# Altium project ATMEGA328P.PrjPcb
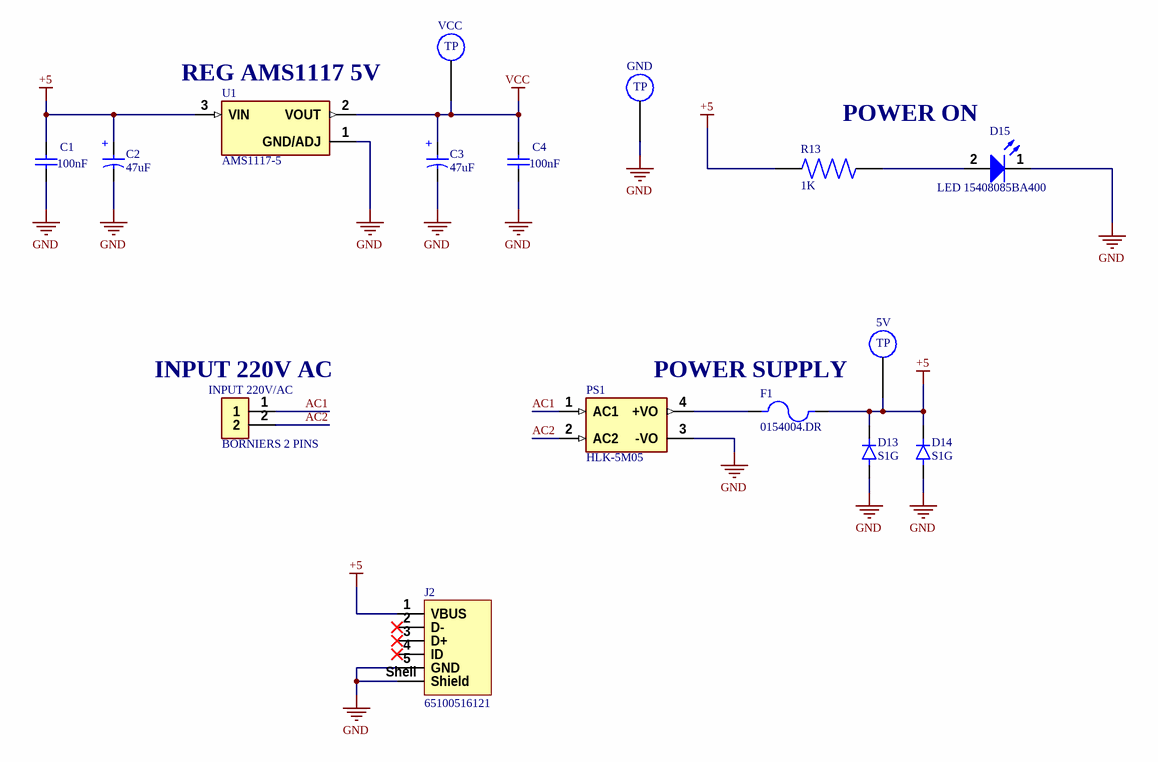
[diagram p0: Power.SchDoc]
3 sheets, 75 parts. Net scope: global (net labels, ports and power ports of the same name join across sheets).
Board file: ATMEGA328P.PcbDoc
Sheets:
  Power.SchDoc
  Controller.SchDoc
  Relay.SchDoc

## Sheet Power.SchDoc
size A4; SheetNumber: 1; SheetTotal: 3

### Parts
5V  TEST POINT  [TEST POINT]  (value not drawn)  (no BOM)
C1  100nF  [WCAP-CSGP_0603_L1.6W0.8H0.8_Reflow]
C2  Capacitance: 47uF  [Cap 865080443007]  (hidden comment: Cap 865080443007)
C3  Capacitance: 47uF  [Cap 865080443007]  (hidden comment: Cap 865080443007)
C4  100nF  [WCAP-CSGP_0603_L1.6W0.8H0.8_Reflow]
D13  S1G  [S1G]
D14  S1G  [S1G]
D15  LED 15408085BA400  [LED 15408085BA400]
F1  0154004.DR  [0154004.DR]
GND  TEST POINT  [TEST POINT]  (value not drawn)  (no BOM)
INPUT_220V/AC  BORNIERS 2 PINS  [BORNIERS 2 PINS]
J2  65100516121  [WR-USB-65100516121]
PS1  HLK-5M05  [HLK-5M05]
R13  1K  [RES FCR1206J10R]
U1  AMS1117-5  [AMS1117-5]
VCC  TEST POINT  [TEST POINT]  (value not drawn)  (no BOM)

### Nets
+5: 5V.1 C1.2 C2.1(P) D13.1(K) D14.1(K) F1.2 J2.1(VBUS) R13.1 U1.3(VIN)
GND: C1.1 C2.2(N) C3.2(N) C4.1 D13.2(A) D14.2(A) D15.1(K) GND.1 J2.5(GND) J2.Shell(Shield) PS1.3(-VO) U1.1(GND/ADJ)
VCC: C3.1(P) C4.2 U1.2(VOUT) VCC.1
AC1: INPUT_220V/AC.1 PS1.1(AC1)
AC2: INPUT_220V/AC.2 PS1.2(AC2)
NetD15_2: D15.2(A) R13.2
NetF1_1: F1.1 PS1.4(+VO)

Not connected (* = marked no-connect by the designer): J2 2(D-)* 3(D+)* 4(ID)*

### Notes on the sheet
- (near VCC) VCC
- (near U1) REG AMS1117 5V
- (near GND) GND
- (near R13) POWER ON
- (near 5V) 5V
- (near INPUT_220V/AC) INPUT 220V AC
- POWER SUPPLY
- (in symbol Cap 865080443007) +
- (in symbol TEST POINT) TP

### Library data of the parts
C1 C4 = 885012206071: WCAP-CSGP Multilayer Ceramic Chip Capacitor, General Purpose, size 0603, 100nF, 25V; Manufacturer: Wurth Elektronik; Case/Size Code: 0603; Capacitance Tolerance: +/-10%; Ceramic Type: X7R; Dissipation Factor: 3.5%; Insulation Resistance: 5GΩ; Technical Reference: X7R0603104K025DFCT10000; Manufacturer Part Number: 885012206071; Category: Multilayer Ceramic Chip Capacitors; Match Code: WCAP-CSGP; ComponentLink1Description: Website Link; ComponentLink1URL: https://www.we-online.com/redexpert/article/885012206071?ad; ComponentLink2Description: Datasheet Link; ComponentLink2URL: https://www.we-online.com/redexpert/spec/885012206071?ad; Mount: Surface Mount; Min Operating Temperature: -55°C; Max Operating Temperature: 125°C; Packaging: Tape and Reel; Length: 1.6mm; Width: 0.8mm; Height: 0.8mm; Capacitance: 100nF; Rated Voltage (DC): 25V
C2 C3 = Cap 865080443007: WCAP-ASLI Aluminum Electrolytic Capacitor, V-Chip, D6.3 x H5.5mm, 47uF, 25V; Manufacturer: Wurth Elektronik; Capacitance Tolerance: +/-20%; Dissipation Factor: 14%; Endurance: 2000h; Leakage Current: 11.75uA; Ripple Current: 220mA; Technical Reference: ASED055470M025DVCTBB000; Manufacturer Part Number: 865080443007; Category: Aluminum Electrolytic Capacitors; Match Code: WCAP-ASLI; ComponentLink1Description: Website Link; ComponentLink1URL: https://www.we-online.com/redexpert/article/865080443007?ad; ComponentLink2Description: Datasheet Link; ComponentLink2URL: https://www.we-online.com/redexpert/spec/865080443007?ad; Mount: Surface Mount; Operating Temperature Max: 105°C; Operating Temperature Min: -55°C; Packaging: Tape and Reel; Height: 5.5mm; Diameter: 6.3mm; Rated Voltage (DC): 25V
D13 D14 = S1G: Diode Standard 400 V 1A Surface Mount DO-214AC (SMA); MF: ON Semiconductor; SnapEDA_Link: https://www.snapeda.com/parts/S1G/Onsemi/view-part/?ref=snap; Package: SMA-2 ON Semiconductor; Value: *; MP: S1G; Check_prices: https://www.snapeda.com/parts/S1G/Onsemi/view-part/?ref=eda
D15 = LED 15408085BA400: SMT Infrared Chip LED Infrared Waterclear, body 2x1.3mm, size 0805, Infrared, 1.4V, 140°; Manufacturer: Wurth Elektronik; Match Code: WL-SICW; Case/Size Code: 0805; Centroid Wavelength: 845nm; Chip Technology: AlGaAs; Forward Voltage Max: 2V; Peak Wavelength: 850nm; Radiant Intensity: 1.5mW/sr; Radiant Intensity Min: 0.6mW/sr; Manufacturer Part Number: 15408085BA400; Category: Infrared LEDs; ComponentLink1Description: Website Link; ComponentLink1URL: https://www.we-online.com/redexpert/article/15408085BA400?ad; ComponentLink2Description: Datasheet Link; ComponentLink2URL: https://www.we-online.com/redexpert/spec/15408085BA400?ad; Mount: Surface Mount; Operating Temperature Max: 85°C; Operating Temperature Min: -40°C; Packaging: Tape and Reel; Length: 2mm; Width: 1.3mm; Height: 0.8mm; Emitting Color: Infrared; Forward Voltage: 1.4V; Viewing Angle: 140°
F1 = 0154004.DR: Nano2 SMD FF submin fuse w/holder, 4A | Littelfuse 0154004.DR; MF: Littelfuse Inc.; SnapEDA_Link: https://www.snapeda.com/parts/0154004.DR/Littelfuse/view-part/?ref=snap; Package: SMD-2 Littelfuse; Value: *; MP: 0154004.DR; Check_prices: https://www.snapeda.com/parts/0154004.DR/Littelfuse/view-part/?ref=eda
INPUT_220V/AC = BORNIERS 2 PINS: Terminal Block Connector Wire Receptacle 2
J2 = WR-USB-65100516121: WR-COM Mini USB 2.0 Type B SMT Horizontal 5 Contacts; Manufacturer: Wurth Elektronik; Match Code: WR-USB; Gender: Receptacle; Interface Type: Type B; Number of Ports: 1; Rated Current: 1A; Working Voltage: 30V (AC); Manufacturer Part Number: 65100516121; Category: Input/Output Connectors; ComponentLink1Description: Website Link; ComponentLink1URL: https://www.we-online.com/redexpert/article/65100516121?ad; ComponentLink2Description: Datasheet Link; ComponentLink2URL: https://www.we-online.com/redexpert/spec/65100516121?ad; Mount: Surface Mount; Min Operating Temperature: -40°C; Max Operating Temperature: 105°C; Packaging: Tape and Reel & Mylar; Application: Mini USB 2.0; Number of Pins: 5; Orientation: Horizontal
PS1 = HLK-5M05: AC-DC Power Supply Module HLK-5M05 220V to 5V 1A; MF: {'manufacturer': u'Hi-link'}; Package: None; Price: None; Value: *; MP: HLK-5M05; Availability: Unavailable
R13 = RES FCR1206J10R: RES 1206 10 Ohm 5% 1/8W ±500ppm/°C Molded SMD SMD T/R; Resistance: 10; Power_Rating: .125 W; MF: TE Connectivity; DigiKey-Purchase-URL: https://snapeda.com/shop?store=DigiKey&id=988597; Package: 1206; EU_RoHS_Compliance: Compliant with Exemptions; Tolerance: 5%; Value: *; MP: FCR1206J10R; Price: None; SnapEDA_Link: https://www.snapeda.com/parts/FCR1206J10R/TE%20Connectivity%20Passive%20Product/view-part/988597/?ref=snap; Mouser-Purchase-URL: https://snapeda.com/shop?store=Mouser&id=988597; Availability: Warning
U1 = AMS1117-5: Sot223/Pkg 1-Amp 5-Volt Low Drop Out Voltage Regulatator; MF: Advanced Monolithic Systems; MP: AMS1117-3.3; SnapEDA_Link: https://www.snapeda.com/parts/AMS1117-3.3/Advanced+Monolithic+Systems/view-part/?ref=snap; Package: SOT-223 Seeed Technology; Value: *; Check_prices: https://www.snapeda.com/parts/AMS1117-3.3/Advanced+Monolithic+Systems/view-part/?ref=eda

## Sheet Controller.SchDoc
size A4; SheetNumber: 2; SheetTotal: 3
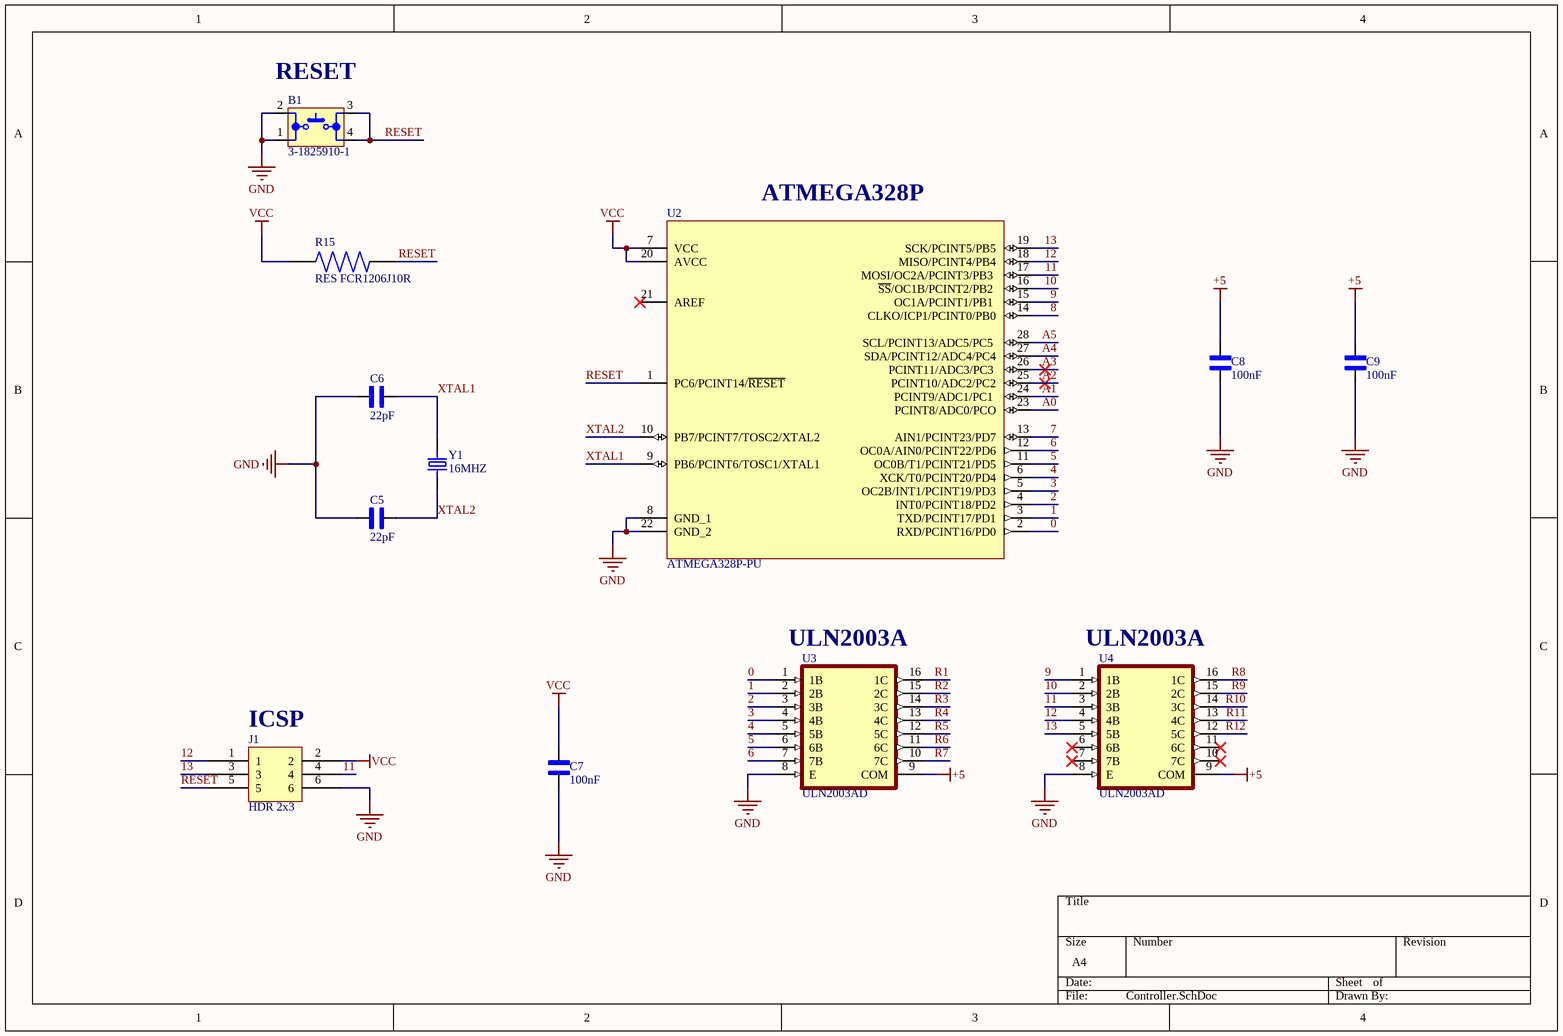
[diagram p1: Controller.SchDoc]

### Parts
B1  3-1825910-1  [3-1825910-1]
C5  22pF  [0805Y0500220JCT]
C6  22pF  [0805Y0500220JCT]
C7  100nF  [0805Y0500220JCT]
C8  100nF  [0805Y0500220JCT]
C9  100nF  [0805Y0500220JCT]
J1  HDR 2x3  [PIN Header Double Male 2x3]
R15  RES FCR1206J10R  [RES FCR1206J10R]
U2  ATMEGA328P-PU  [ATMEGA328P-PU]
U3  ULN2003AD  [ULN2003AD]
U4  ULN2003AD  [ULN2003AD]
Y1  16MHZ  [ECS-160-20-3X-TR]

### Nets
+5: C8.2 C9.2 U3.9(COM) U4.9(COM)
GND: B1.1 B1.2 C5.1 C6.1 C7.1 C8.1 C9.1 J1.6 U2.8(GND_1) U2.22(GND_2) U3.8(E) U4.8(E)
VCC: C7.2 J1.2 R15.1 U2.7(VCC) U2.20(AVCC)
0: U2.2(RXD/PCINT16/PD0) U3.1(1B)
1: U2.3(TXD/PCINT17/PD1) U3.2(2B)
2: U2.4(INT0/PCINT18/PD2) U3.3(3B)
3: U2.5(OC2B/INT1/PCINT19/PD3) U3.4(4B)
4: U2.6(XCK/T0/PCINT20/PD4) U3.5(5B)
5: U2.11(OC0B/T1/PCINT21/PD5) U3.6(6B)
6: U2.12(OC0A/AIN0/PCINT22/PD6) U3.7(7B)
7: U2.13(AIN1/PCINT23/PD7)
8: U2.14(CLKO/ICP1/PCINT0/PB0)
9: U2.15(OC1A/PCINT1/PB1) U4.1(1B)
10: U2.16(~{SS}/OC1B/PCINT2/PB2) U4.2(2B)
11: J1.4 U2.17(MOSI/OC2A/PCINT3/PB3) U4.3(3B)
12: J1.1 U2.18(MISO/PCINT4/PB4) U4.4(4B)
13: J1.3 U2.19(SCK/PCINT5/PB5) U4.5(5B)
A0: U2.23(PCINT8/ADC0/PCO)
A1: U2.24(PCINT9/ADC1/PC1)
A2: U2.25(PCINT10/ADC2/PC2)
A3: U2.26(PCINT11/ADC3/PC3)
A4: U2.27(SDA/PCINT12/ADC4/PC4)
A5: U2.28(SCL/PCINT13/ADC5/PC5)
R1: U3.16(1C)
R2: U3.15(2C)
R3: U3.14(3C)
R4: U3.13(4C)
R5: U3.12(5C)
R6: U3.11(6C)
R7: U3.10(7C)
R8: U4.16(1C)
R9: U4.15(2C)
R10: U4.14(3C)
R11: U4.13(4C)
R12: U4.12(5C)
RESET: B1.3 B1.4 J1.5 R15.2 U2.1(PC6/PCINT14/~{RESET})
XTAL1: C6.2 U2.9(PB6/PCINT6/TOSC1/XTAL1) Y1.2
XTAL2: C5.2 U2.10(PB7/PCINT7/TOSC2/XTAL2) Y1.1

Not connected (* = marked no-connect by the designer): U2 21(AREF)*; U4 6(6B)* 7(7B)* 10(7C)* 11(6C)*

### Notes on the sheet
- (near B1) RESET
- (near U2) ATMEGA328P
- (near U3) ULN2003A
- (near U4) ULN2003A
- (near J1) ICSP

### Library data of the parts
B1 = 3-1825910-1: Switch Push Button OFF (ON) SPST Round Button 0.05A 24VDC Momentary Contact PC Pins Thru-Hole; Manufacturer: TE Connectivity Alcoswitch; Manufacturer Part Number: 1825910-6; Actuator Material: PBT; Mechanical Life: 100000Cycles; Operating Force: 160gf; Illumination Type: Non-Illuminated,Illuminated; Switch Travel: 0.25mm; Switch Function: Off-Mom; Max Voltage Rating (DC): 24V; Contact Current Rating: 50mA; Actuator Type: Standard; Contact Resistance: 100mR; Actuator Length: 0.055inch; RoHS: Yes; Category: Pushbutton Switches; Stock 1: 97530; Pricing 1: 1=0,10000, 10=0,10100, 25=0,09560, 100=0,08700, 250=0,08180, 500=0,07484, 1000=0,06265, 2500=0,06092, 5000=0,05743 (USD); Mount: Through Hole; Contact Material: Copper Alloy; Contact Plating: Silver; Min Operating Temperature: -35°C; Max Operating Temperature: 85°C; Termination: PC Pins; Throw Configuration: SPST; Package Quantity: 750; Packaging: Loose Piece; Orientation: Straight; Electrical Life: 100000Cycles; Max Current Rating: 50mA; Type: Switch; Length: 5.99mm; REACH SVHC: Unknown; ELV: Compliant; Lead Free: Lead Free; ComponentLink1URL: https://datasheet.ciiva.com/30199/1825910-6rqpn1825910-6-30199520.pdf?src-supplier=Onlinecomponents.com; ComponentLink1Description: https://datasheet.ciiva.com/30199/1825910-6rqpn1825910-6-30199520.pdf?src-supplier=Onlinecomponents.com; ComponentLink2URL: https://datasheet.ciiva.com/15184/getdatasheetpartid-395915-15184509.pdf?src-supplier=Verical; ComponentLink2Description: https://datasheet.ciiva.com/15184/getdatasheetpartid-395915-15184509.pdf?src-supplier=Verical; Supplier 1: Digi-Key; Supplier Part Number 1: 450-1650-ND
C5-C9 = 0805Y0500220JCT: 22pF ±5% 50V Ceramic Capacitor C0G, NP0 (1B) 0805 (2012 Metric); MF: Syfer; SnapEDA_Link: https://www.snapeda.com/parts/0805Y0500220JCT/Syfer/view-part/?ref=snap; Package: 2012 Knowles Syfer; Value: *; MP: 0805Y0500220JCT; Check_prices: https://www.snapeda.com/parts/0805Y0500220JCT/Syfer/view-part/?ref=eda
J1 = PIN Header Double Male 2x3: PIN Header Double Male 2x3 TH Pitch 2.54mm
R15 = RES FCR1206J10R: as R13 on sheet Power; DigiKey-Purchase-URL: https://snapeda.com/shop?store=DigiKey&id=988597; Package: 1206; EU_RoHS_Compliance: Compliant with Exemptions; Tolerance: 5%; Value: *; MP: FCR1206J10R; Price: None; SnapEDA_Link: https://www.snapeda.com/parts/FCR1206J10R/TE%20Connectivity%20Passive%20Product/view-part/988597/?ref=snap; Mouser-Purchase-URL: https://snapeda.com/shop?store=Mouser&id=988597; Availability: Warning
U2 = ATMEGA328P-PU: AVR ATMEGA Microcontroller IC 8-Bit 20MHz 32KB (16K x 16) FLASH 28-PDIP; Manufacturer: Microchip; Supplier 1: Digi-Key; Manufacturer Part Number: ATMEGA328P-PU; RoHS: Yes; Category: Microcontrollers; Pricing 1: 1=2.82000, 25=2.58760, 100=2.34000 (USD); Number of Pins: 28; RoHS Compliant: Yes; ComponentLink1URL: http://www.microchip.com/mymicrochip/filehandler.aspx?ddocname=en589968&src-supplier=Jameco; ComponentLink1Description: http://www.microchip.com/mymicrochip/filehandler.aspx?ddocname=en589968&src-supplier=Jameco; ComponentLink2URL: http://www.microchip.com/mymicrochip/filehandler.aspx?ddocname=en589968&src-supplier=Avnet+Europe; ComponentLink2Description: http://www.microchip.com/mymicrochip/filehandler.aspx?ddocname=en589968&src-supplier=Avnet+Europe; ComponentLink3URL: http://www.microchip.com/mymicrochip/filehandler.aspx?ddocname=en589968&src-supplier=Digi-Key; ComponentLink3Description: http://www.microchip.com/mymicrochip/filehandler.aspx?ddocname=en589968&src-supplier=Digi-Key; ComponentLink4URL: http://www.microchip.com/mymicrochip/filehandler.aspx?ddocname=en589968&src-supplier=Onlinecomponents.com; ComponentLink4Description: http://www.microchip.com/mymicrochip/filehandler.aspx?ddocname=en589968&src-supplier=Onlinecomponents.com; ComponentLink5URL: http://www.microchip.com/mymicrochip/filehandler.aspx?ddocname=en589968&src-supplier=Avnet; ComponentLink5Description: http://www.microchip.com/mymicrochip/filehandler.aspx?ddocname=en589968&src-supplier=Avnet; ComponentLink6URL: http://www.farnell.com/datasheets/798182.pdf?src-supplier=Newark; ComponentLink6Description: http://www.farnell.com/datasheets/798182.pdf?src-supplier=Newark; ComponentLink7URL: http://www.microchip.com/mymicrochip/filehandler.aspx?ddocname=en589968&src-supplier=Verical; ComponentLink7Description: http://www.microchip.com/mymicrochip/filehandler.aspx?ddocname=en589968&src-supplier=Verical; ComponentLink8URL: http://www.farnell.com/datasheets/2047852.pdf?src-supplier=Element14; ComponentLink8Description: http://www.farnell.com/datasheets/2047852.pdf?src-supplier=Element14; ComponentLink9URL: https://4donline.ihs.com/images/VipMasterIC/IC/ATML/ATML-S-A0002642585/ATML-S-A0002642585-1.pdf?hkey=6D3A4C79FDBF58556ACFDE234799DDF0&src-supplier=Farnell; ComponentLink9Description: https://4donline.ihs.com/images/VipMasterIC/IC/ATML/ATML-S-A0002642585/ATML-S-A0002642585-1.pdf?hkey=6D3A4C79FDBF58556ACFDE234799DDF0&src-supplier=Farnell; ComponentLink10URL: http://www.microchip.com/mymicrochip/filehandler.aspx?ddocname=en589968&src-supplier=RSComponents; ComponentLink10Description: http://www.microchip.com/mymicrochip/filehandler.aspx?ddocname=en589968&src-supplier=RSComponents; ComponentLink11URL: http://www.microchip.com/mymicrochip/filehandler.aspx?ddocname=en589968&src-supplier=Mouser; ComponentLink11Description: http://www.microchip.com/mymicrochip/filehandler.aspx?ddocname=en589968&src-supplier=Mouser; ComponentLink12URL: http://www.microchip.com/mymicrochip/filehandler.aspx?ddocname=en589968&src-supplier=Conrad; ComponentLink12Description: http://www.microchip.com/mymicrochip/filehandler.aspx?ddocname=en589968&src-supplier=Conrad; ComponentLink13URL: http://www.microchip.com/mymicrochip/filehandler.aspx?ddocname=en589968&src-supplier=Rochester+Electronics; ComponentLink13Description: http://www.microchip.com/mymicrochip/filehandler.aspx?ddocname=en589968&src-supplier=Rochester+Electronics; ComponentLink14URL: http://www.microchip.com/mymicrochip/filehandler.aspx?ddocname=en589968&src-supplier=TME; ComponentLink14Description: http://www.microchip.com/mymicrochip/filehandler.aspx?ddocname=en589968&src-supplier=TME; ComponentLink15URL: http://www.microchip.com/mymicrochip/filehandler.aspx?ddocname=en589968&src-supplier=Schukat; ComponentLink15Description: http://www.microchip.com/mymicrochip/filehandler.aspx?ddocname=en589968&src-supplier=Schukat; ComponentLink16URL: http://www.microchip.com/mymicrochip/filehandler.aspx?ddocname=en589968&src-supplier=microchipDIRECT; ComponentLink16Description: http://www.microchip.com/mymicrochip/filehandler.aspx?ddocname=en589968&src-supplier=microchipDIRECT; ComponentLink17URL: http://www.microchip.com/mymicrochip/filehandler.aspx?ddocname=en589968&src-supplier=SOS+electronic; ComponentLink17Description: http://www.microchip.com/mymicrochip/filehandler.aspx?ddocname=en589968&src-supplier=SOS+electronic; ComponentLink18URL: http://www.microchip.com/mymicrochip/filehandler.aspx?ddocname=en589968&src-supplier=NAC+Semi; ComponentLink18Description: http://www.microchip.com/mymicrochip/filehandler.aspx?ddocname=en589968&src-supplier=NAC+Semi; ComponentLink19URL: http://www.microchip.com/mymicrochip/filehandler.aspx?ddocname=en589968&src-supplier=Electro+Sonic; ComponentLink19Description: http://www.microchip.com/mymicrochip/filehandler.aspx?ddocname=en589968&src-supplier=Electro+Sonic; Supplier Part Number 1: ATMEGA328P-PU-ND
U3 U4 = ULN2003AD: 50-V, 7-ch darlington transistor array, -20C to 70C; MF: Texas Instruments; SnapEDA_Link: https://www.snapeda.com/parts/ULN2003AD/Texas+Instruments/view-part/?ref=snap; Package: SOIC-16 Texas Instruments; Value: *; MP: ULN2003AD; Check_prices: https://www.snapeda.com/parts/ULN2003AD/Texas+Instruments/view-part/?ref=eda
Y1 = ECS-160-20-3X-TR: 20 MHz ±30ppm Crystal Series 20pF 50 Ohms HC-49/US

## Sheet Relay.SchDoc
size A4; SheetNumber: 3; SheetTotal: 3
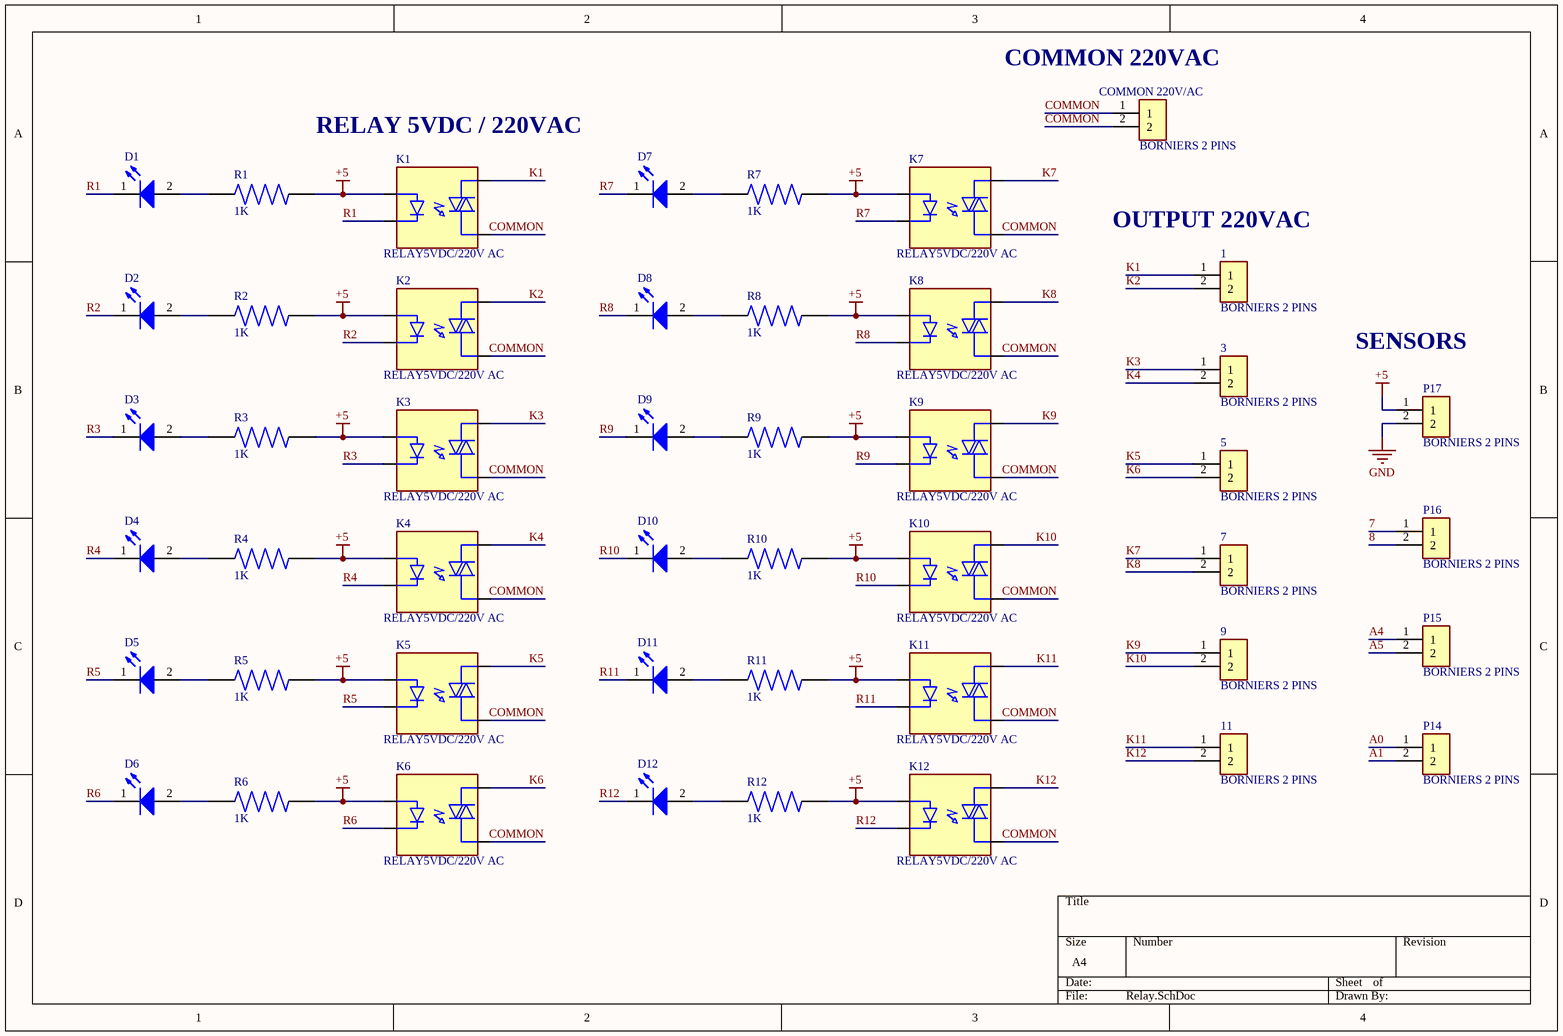
[diagram p2: Relay.SchDoc]

### Parts
1  BORNIERS 2 PINS  [BORNIERS 2 PINS]
3  BORNIERS 2 PINS  [BORNIERS 2 PINS]
5  BORNIERS 2 PINS  [BORNIERS 2 PINS]
7  BORNIERS 2 PINS  [BORNIERS 2 PINS]
9  BORNIERS 2 PINS  [BORNIERS 2 PINS]
11  BORNIERS 2 PINS  [BORNIERS 2 PINS]
COMMON_220V/AC  BORNIERS 2 PINS  [BORNIERS 2 PINS]
D1  LED 15408085BA400  [LED 15408085BA400]  (value not drawn)
D2  LED 15408085BA400  [LED 15408085BA400]  (value not drawn)
D3  LED 15408085BA400  [LED 15408085BA400]  (value not drawn)
D4  LED 15408085BA400  [LED 15408085BA400]  (value not drawn)
D5  LED 15408085BA400  [LED 15408085BA400]  (value not drawn)
D6  LED 15408085BA400  [LED 15408085BA400]  (value not drawn)
D7  LED 15408085BA400  [LED 15408085BA400]  (value not drawn)
D8  LED 15408085BA400  [LED 15408085BA400]  (value not drawn)
D9  LED 15408085BA400  [LED 15408085BA400]  (value not drawn)
D10  LED 15408085BA400  [LED 15408085BA400]  (value not drawn)
D11  LED 15408085BA400  [LED 15408085BA400]  (value not drawn)
D12  LED 15408085BA400  [LED 15408085BA400]  (value not drawn)
K1  RELAY5VDC/220V AC  [G3MB-202P DC5]
K2  RELAY5VDC/220V AC  [G3MB-202P DC5]
K3  RELAY5VDC/220V AC  [G3MB-202P DC5]
K4  RELAY5VDC/220V AC  [G3MB-202P DC5]
K5  RELAY5VDC/220V AC  [G3MB-202P DC5]
K6  RELAY5VDC/220V AC  [G3MB-202P DC5]
K7  RELAY5VDC/220V AC  [G3MB-202P DC5]
K8  RELAY5VDC/220V AC  [G3MB-202P DC5]
K9  RELAY5VDC/220V AC  [G3MB-202P DC5]
K10  RELAY5VDC/220V AC  [G3MB-202P DC5]
K11  RELAY5VDC/220V AC  [G3MB-202P DC5]
K12  RELAY5VDC/220V AC  [G3MB-202P DC5]
P14  BORNIERS 2 PINS  [BORNIERS 2 PINS]
P15  BORNIERS 2 PINS  [BORNIERS 2 PINS]
P16  BORNIERS 2 PINS  [BORNIERS 2 PINS]
P17  BORNIERS 2 PINS  [BORNIERS 2 PINS]
R1  1K  [RES FCR1206J10R]
R2  1K  [RES FCR1206J10R]
R3  1K  [RES FCR1206J10R]
R4  1K  [RES FCR1206J10R]
R5  1K  [RES FCR1206J10R]
R6  1K  [RES FCR1206J10R]
R7  1K  [RES FCR1206J10R]
R8  1K  [RES FCR1206J10R]
R9  1K  [RES FCR1206J10R]
R10  1K  [RES FCR1206J10R]
R11  1K  [RES FCR1206J10R]
R12  1K  [RES FCR1206J10R]

### Nets
+5: K1.3(ANODE) K2.3(ANODE) K3.3(ANODE) K4.3(ANODE) K5.3(ANODE) K6.3(ANODE) K7.3(ANODE) K8.3(ANODE) K9.3(ANODE) K10.3(ANODE) K11.3(ANODE) K12.3(ANODE) P17.1 R1.2 R2.2 R3.2 R4.2 R5.2 R6.2 R7.2 R8.2 R9.2 R10.2 R11.2 R12.2
GND: P17.2
7: P16.1
8: P16.2
A0: P14.1
A1: P14.2
A4: P15.1
A5: P15.2
COMMON: COMMON_220V/AC.1 COMMON_220V/AC.2 K1.2(LOAD2) K2.2(LOAD2) K3.2(LOAD2) K4.2(LOAD2) K5.2(LOAD2) K6.2(LOAD2) K7.2(LOAD2) K8.2(LOAD2) K9.2(LOAD2) K10.2(LOAD2) K11.2(LOAD2) K12.2(LOAD2)
K1: 1.1 K1.1(LOAD1)
K2: 1.2 K2.1(LOAD1)
K3: 3.1 K3.1(LOAD1)
K4: 3.2 K4.1(LOAD1)
K5: 5.1 K5.1(LOAD1)
K6: 5.2 K6.1(LOAD1)
K7: 7.1 K7.1(LOAD1)
K8: 7.2 K8.1(LOAD1)
K9: 9.1 K9.1(LOAD1)
K10: 9.2 K10.1(LOAD1)
K11: 11.1 K11.1(LOAD1)
K12: 11.2 K12.1(LOAD1)
R1: D1.1(K) K1.4(CATHODE)
R2: D2.1(K) K2.4(CATHODE)
R3: D3.1(K) K3.4(CATHODE)
R4: D4.1(K) K4.4(CATHODE)
R5: D5.1(K) K5.4(CATHODE)
R6: D6.1(K) K6.4(CATHODE)
R7: D7.1(K) K7.4(CATHODE)
R8: D8.1(K) K8.4(CATHODE)
R9: D9.1(K) K9.4(CATHODE)
R10: D10.1(K) K10.4(CATHODE)
R11: D11.1(K) K11.4(CATHODE)
R12: D12.1(K) K12.4(CATHODE)
NetD1_2: D1.2(A) R1.1
NetD2_2: D2.2(A) R2.1
NetD3_2: D3.2(A) R3.1
NetD4_2: D4.2(A) R4.1
NetD5_2: D5.2(A) R5.1
NetD6_2: D6.2(A) R6.1
NetD7_2: D7.2(A) R7.1
NetD8_2: D8.2(A) R8.1
NetD9_2: D9.2(A) R9.1
NetD10_2: D10.2(A) R10.1
NetD11_2: D11.2(A) R11.1
NetD12_2: D12.2(A) R12.1

### Notes on the sheet
- (near COMMON_220V/AC) COMMON 220VAC
- RELAY 5VDC / 220VAC
- (near 1) OUTPUT 220VAC
- SENSORS

### Library data of the parts
1 3 5 7 9 11 COMMON_220V/AC P14-P17 = BORNIERS 2 PINS: as INPUT_220V/AC on sheet Power
D1-D12 = LED 15408085BA400: as D15 on sheet Power; Manufacturer Part Number: 15408085BA400; Category: Infrared LEDs; ComponentLink1Description: Website Link; ComponentLink1URL: https://www.we-online.com/redexpert/article/15408085BA400?ad; ComponentLink2Description: Datasheet Link; ComponentLink2URL: https://www.we-online.com/redexpert/spec/15408085BA400?ad; Mount: Surface Mount; Operating Temperature Max: 85°C; Operating Temperature Min: -40°C; Packaging: Tape and Reel; Length: 2mm; Width: 1.3mm; Height: 0.8mm; Emitting Color: Infrared; Forward Voltage: 1.4V; Viewing Angle: 140°
K1-K12 = G3MB-202P DC5: Solid State Photo-Coupled Relay (PhotoRelay) SPST-NO (1 Form A) 4-SIP; MF: Omron Automation; SnapEDA_Link: https://www.snapeda.com/parts/G3MB-202P/Omron/view-part/?ref=snap; Package: SIP-4 Omron Automation; Value: *; MP: G3MB-202P; Check_prices: https://www.snapeda.com/parts/G3MB-202P/Omron/view-part/?ref=eda
R1-R12 = RES FCR1206J10R: as R13 on sheet Power; DigiKey-Purchase-URL: https://snapeda.com/shop?store=DigiKey&id=988597; Package: 1206; EU_RoHS_Compliance: Compliant with Exemptions; Tolerance: 5%; Value: *; MP: FCR1206J10R; Price: None; SnapEDA_Link: https://www.snapeda.com/parts/FCR1206J10R/TE%20Connectivity%20Passive%20Product/view-part/988597/?ref=snap; Mouser-Purchase-URL: https://snapeda.com/shop?store=Mouser&id=988597; Availability: Warning

## Nets that join several sheets
+5: Power (9 pins), Controller (C8.2 C9.2 U3.9 U4.9), Relay (25 pins)
GND: Power (12 pins), Controller (12 pins), Relay (P17.2)
VCC: Power (C3.1 C4.2 U1.2 VCC.1), Controller (5 pins)
7: Controller (U2.13), Relay (P16.1)
8: Controller (U2.14), Relay (P16.2)
A0: Controller (U2.23), Relay (P14.1)
A1: Controller (U2.24), Relay (P14.2)
A4: Controller (U2.27), Relay (P15.1)
A5: Controller (U2.28), Relay (P15.2)
R1: Controller (U3.16), Relay (D1.1 K1.4)
R2: Controller (U3.15), Relay (D2.1 K2.4)
R3: Controller (U3.14), Relay (D3.1 K3.4)
R4: Controller (U3.13), Relay (D4.1 K4.4)
R5: Controller (U3.12), Relay (D5.1 K5.4)
R6: Controller (U3.11), Relay (D6.1 K6.4)
R7: Controller (U3.10), Relay (D7.1 K7.4)
R8: Controller (U4.16), Relay (D8.1 K8.4)
R9: Controller (U4.15), Relay (D9.1 K9.4)
R10: Controller (U4.14), Relay (D10.1 K10.4)
R11: Controller (U4.13), Relay (D11.1 K11.4)
R12: Controller (U4.12), Relay (D12.1 K12.4)